# EAGLE schematic 60-hv-amp-digital-switching (EAGLE 6.6.0)
AUTHOR: Sean Leavey; DATE: 2016-07-18; REVISION: 2016-07-18; TITLE: 60-AMPLIFIER-; TITLE2: DIGITAL-SWITCHING
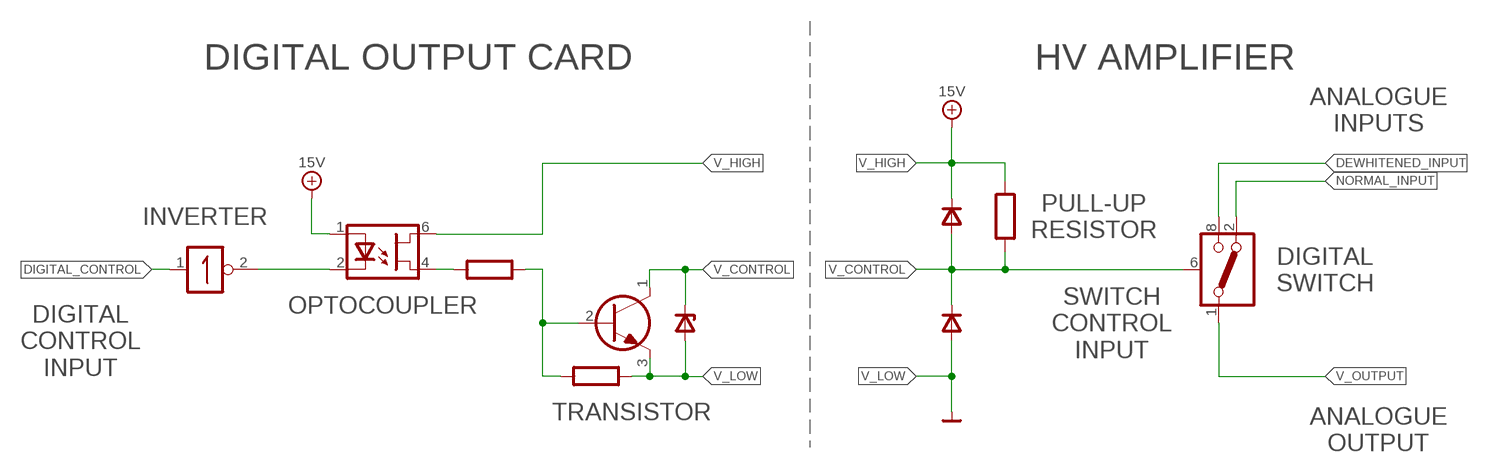
[diagram p0: schematic, sheet 1]

## Parts
D1  DZ  [DZ04N]
D2  D  [D04N-DO35-VALUE]
D3  D  [D04N-DO35-VALUE]
N1  74AC04  [DIP14L]
N2  DG419  [DIP08L]
N3  H11F1  [DIP06L]
R1  R  [DUMMY2]
R2  R  [DUMMY2]
R3  R  [DUMMY2]
T1  BC547  [TO92N]
X1  15V  V+  [DUMMY1]
X2  15V  V+  [DUMMY1]

## Nets
DEWHITENED_INPUT: N2.8(A:S2B)
DIGITAL_CONTROL: N1.1(A:I)
N$1: N1.2(A:O) N3.2(C)
N$2: N3.4(R2) R1.1(N$DUMMY)
N$3: R1.2(N$DUMMY) R2.1(N$DUMMY) T1.2(B)
N$4: N3.1(A) X1.1
NORMAL_INPUT: N2.2(A:S2A)
V_CONTROL: D1.C D2.C D3.A N2.6(A:D) R3.1(N$DUMMY) T1.1(C)
V_HIGH: D3.C N3.6(R1) R3.2(N$DUMMY) X2.1
V_LOW: D1.A D2.A R2.2(N$DUMMY) T1.3(E) ; supply symbol labelled VG
V_OUTPUT: N2.1(A:S1)
Unconnected: N1.3(B:I) N1.4(B:O) N1.5(C:I) N1.6(C:O) N1.8(D:O) N1.9(D:I) N1.10(E:O) N1.11(E:I) N1.12(F:O) N1.13(F:I)

## Notes on the sheet
- DIGITAL OUTPUT CARD | HV AMPLIFIER
- ANALOGUE
  INPUTS
- INVERTER
- PULL-UP
  RESISTOR
- DIGITAL
  SWITCH
- OPTOCOUPLER
- SWITCH
  CONTROL
  INPUT
- DIGITAL
  CONTROL
  INPUT
- TRANSISTOR
- ANALOGUE
  OUTPUT

## Power pins joined to a net without a drawn wire
GND: N1.7(P:GND) N2.3(P:GND)
V+: N1.14(P:V+) N2.4(P:V+)
V-: N2.7(P:V-)
VL: N2.5(P:VL)

## Library data of the parts
D1 = diodes:DZ: Zener diode
D2 D3 = diodes:D: Diode _____ Supported SPICE attributes: VALUE, TEMPERATURE (A detailed description of these parameters can be found in the library spice.lbr); SPICE: <name:D> <pin:A.A> <pin:A.C> <model:<value>><temperature: temp=>
N1 = digitals:*04: 74xx04: Hex inverter _____ References: - PDF datasheets: AC <http://elektronik.aei.uni-hannover.de:3000/datasheets/digitals/gates/inverter/74ac04.pdf>, ACT <http://elektronik.aei.uni-hannover.de:3000/datasheets/digitals/gates/inverter/74act04.pdf>, ALS <http://elektronik.aei.uni-hannover.de:3000/datasheets/digitals/gates/inverter/74als04.pdf>, AS <http://elektronik.aei.uni-hannover.de:3000/datasheets/digitals/gates/inverter/74as04.pdf>, HC <http://elektronik.aei.uni-hannover.de:3000/datasheets/digitals/gates/inverter/74hc04.pdf>, HCT <http://elektronik.aei.uni-hannover.de:3000/datasheets/digitals/gates/inverter/74hct04.pdf>, LS <http://elektronik.aei.uni-hannover.de:3000/datasheets/digitals/gates/inverter/74ls04.pdf>, S <http://elektronik.aei.uni-hannover.de:3000/datasheets/digitals/gates/inverter/74s04.pdf>, TTL <http://elektronik.aei.uni-hannover.de:3000/datasheets/digitals/gates/inverter/7404.pdf> (electronics workshop server) - Manufacturer's links: AC <http://www.ti.com/product/cd74ac04>, ACT <http://www.ti.com/product/cd74act04>, ALS <http://www.ti.com/product/sn74als04b>, AS <http://www.ti.com/product/sn74as04>, HC <http://www.ti.com/product/cd74hc04>, HCT <http://www.ti.com/product/cd74hct04>, LS <http://www.ti.com/product/sn74ls04>, S <http://www.ti.com/product/sn74s04>, TTL <http://www.ti.com/product/sn7404> (Texas Instruments) - Internet search: AC <https://www.google.de/search?q=74ac04>, ACT <https://www.google.de/search?q=74act04>, ALS <https://www.google.de/search?q=74als04>, AS <https://www.google.de/search?q=74as04>, HC <https://www.google.de/search?q=74hc04>, HCT <https://www.google.de/search?q=74hct04>, LS <https://www.google.de/search?q=74ls04>, S <https://www.google.de/search?q=74s04>, TTL <https://www.google.de/search?q=7404> (Google results); VALUE: 74AC04
N2 = ics:DG419: DG419: SPDT analog switch (Maxim) ±15V, 30Ω Ron, 175ns tswitch TTL level inputs, separate digital supply _____ References: - PDF datasheet <http://elektronik.aei.uni-hannover.de:3000/datasheets/ics/switches-multiplexers/dg419.pdf> (electronics workshop server) - Manufacturer's link <http://www.maximintegrated.com/datasheet/index.mvp/id/1005> (Maxim website) - Internet search <http://www.google.de/search?q=dg419> (Google results)
N3 = optos:H11F1: H11F1: FET Optocoupler (Fairchild) 99.9% linearity, 5kV isolation, ±100mA Iout, 200Ω Ron
R1-R3 = symbols:R: Resistor, European symbol; SPICE: <ignore>
T1 = transistors:BC547: BC547: Universal NPN transistor (Motorola, Siemens) 45V Uce, 100mA Ic, 75-900 hfe Complementary type BC557 _____ Supported SPICE models: BC547C BC547B _____ References: - PDF datasheet <http://elektronik.aei.uni-hannover.de:3000/datasheets/transistors/bipolar/npn/bc547.pdf> (electronics workshop server) - Manufacturer's link <http://www.fairchildsemi.com/pf/BC/BC547.html?rd=Y> (Fairchild website) - Internet search <http://www.google.de/search?q=bc547> (Google results); SPICE: <name:Q> <pin:A.C> <pin:A.B> <pin:A.E> <model:BC547C BC547B><temperature: temp=><voltages: ic=>
X1 X2 = symbols:V+: Positive voltage supply symbol; SPICE: <ignore>